# EAGLE design board (EAGLE 7.1.0)
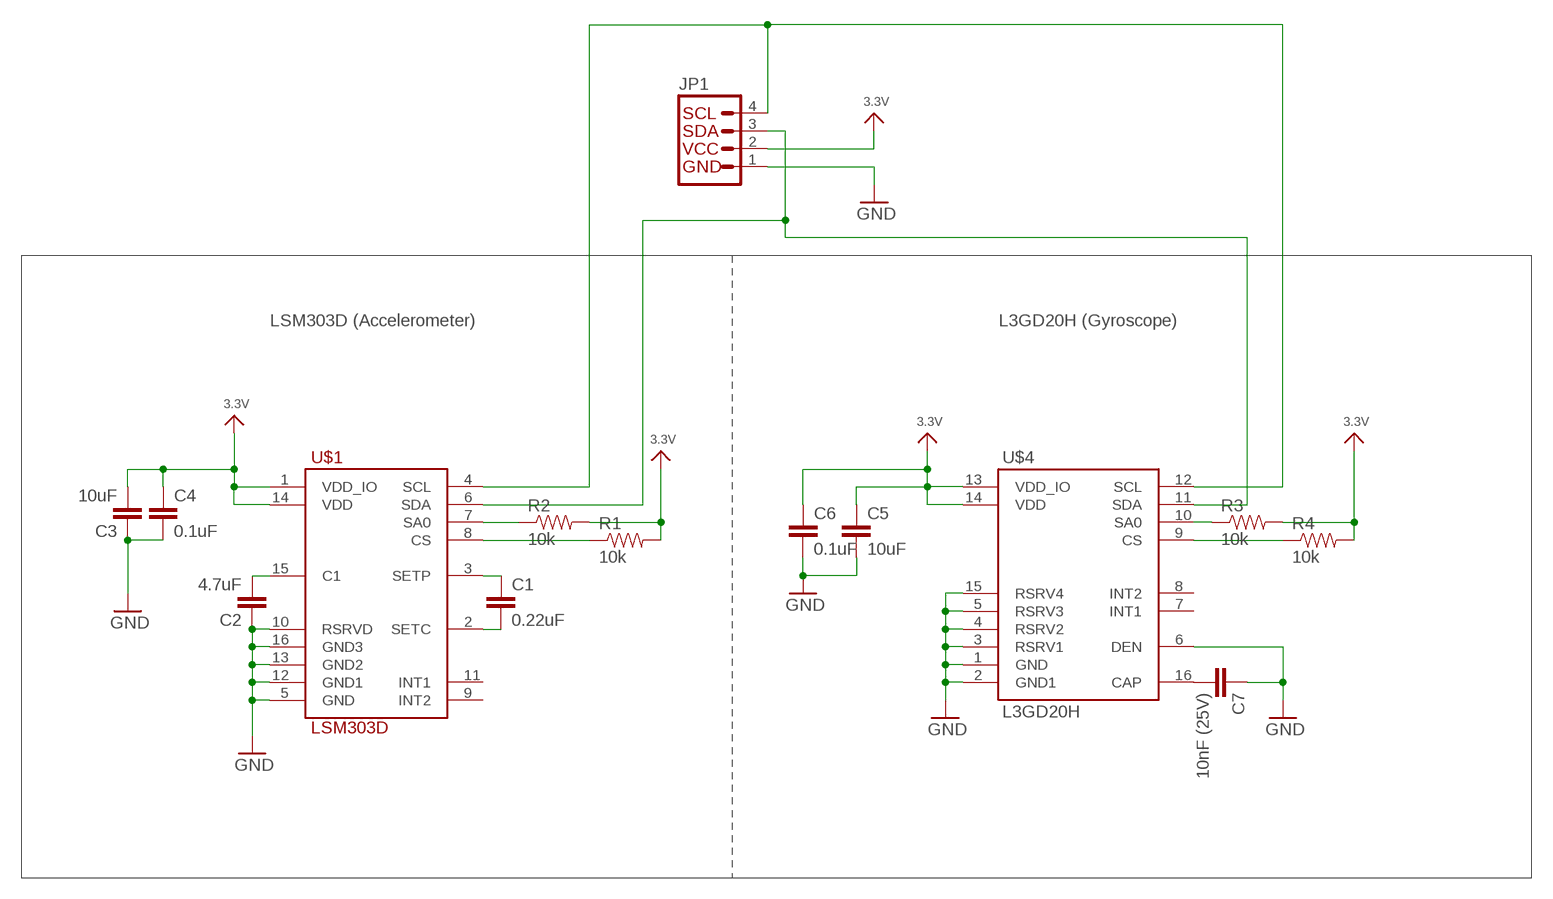
[diagram p0: schematic, sheet 1]

## Parts
C1  0.22uF  CAP0805  [0805]
C2  4.7uF  CAP0805  [0805]
C3  10uF  CAP0805  [0805]
C4  0.1uF  CAP0805  [0805]
C5  10uF  CAP0805  [0805]
C6  0.1uF  CAP0805  [0805]
C7  10nF (25V)  CAP0805  [0805]
JP1  I2C_STANDARD  [1X04]
R1  10k  RESISTOR0805-RES  [0805]
R2  10k  RESISTOR0805-RES  [0805]
R3  10k  RESISTOR0805-RES  [0805]
R4  10k  RESISTOR0805-RES  [0805]
U$1  LSM303D  [LGA16_3X3MM]
U$4  L3GD20H  [LGA16_3X3MM]

## Nets
3.3V: C3.2 C4.1 C5.1 C6.1 JP1.2 R1.2 R2.2 R3.2 R4.2 U$1.1(VDD_IO) U$1.14(VDD) U$4.13(VDD_IO) U$4.14(VDD)
GND: C2.1 C3.1 C4.2 C5.2 C6.2 C7.1 JP1.1 U$1.5(GND) U$1.10(RSRVD) U$1.12(GND1) U$1.13(GND2) U$1.16(GND3) U$4.1(GND) U$4.2(GND1) U$4.3(RSRV1) U$4.4(RSRV2) U$4.5(RSRV3) U$4.6(DEN) U$4.15(RSRV4)
N$1: C1.1 U$1.3(SETP)
N$2: C1.2 U$1.2(SETC)
N$3: R1.1 U$1.8(CS)
N$4: R2.1 U$1.7(SA0)
N$5: C2.2 U$1.15(C1)
N$6: R3.1 U$4.10(SA0)
N$7: R4.1 U$4.9(CS)
N$8: C7.2 U$4.16(CAP)
N$9: JP1.4 U$1.4(SCL) U$4.12(SCL)
N$11: JP1.3 U$1.6(SDA) U$4.11(SDA)
Unconnected: U$1.9(INT2) U$1.11(INT1) U$4.7(INT1) U$4.8(INT2)

## Notes on the sheet
- LSM303D (Accelerometer) | L3GD20H (Gyroscope)

## Library data of the parts
C1-C7 = SparkFun-Capacitors:CAP: Capacitor Standard 0603 ceramic capacitor, and 0.1" leaded capacitor.
JP1 = SparkFun-Connectors:I2C_STANDARD: SparkFun has standardized on a pinout for all I2C based sensor breakouts. This pinout allows I2C boards to be plugged directly into the headers on Arduino Uno compatible boards, and to be daisy chained easily.
R1-R4 = SparkFun-Passives:RESISTOR: Resistor Basic schematic elements and footprints for 0603, 1206, and PTH resistors.
U$1 = IMU_parts:LSM303D
U$4 = IMU_parts:L3GD20H

## Board
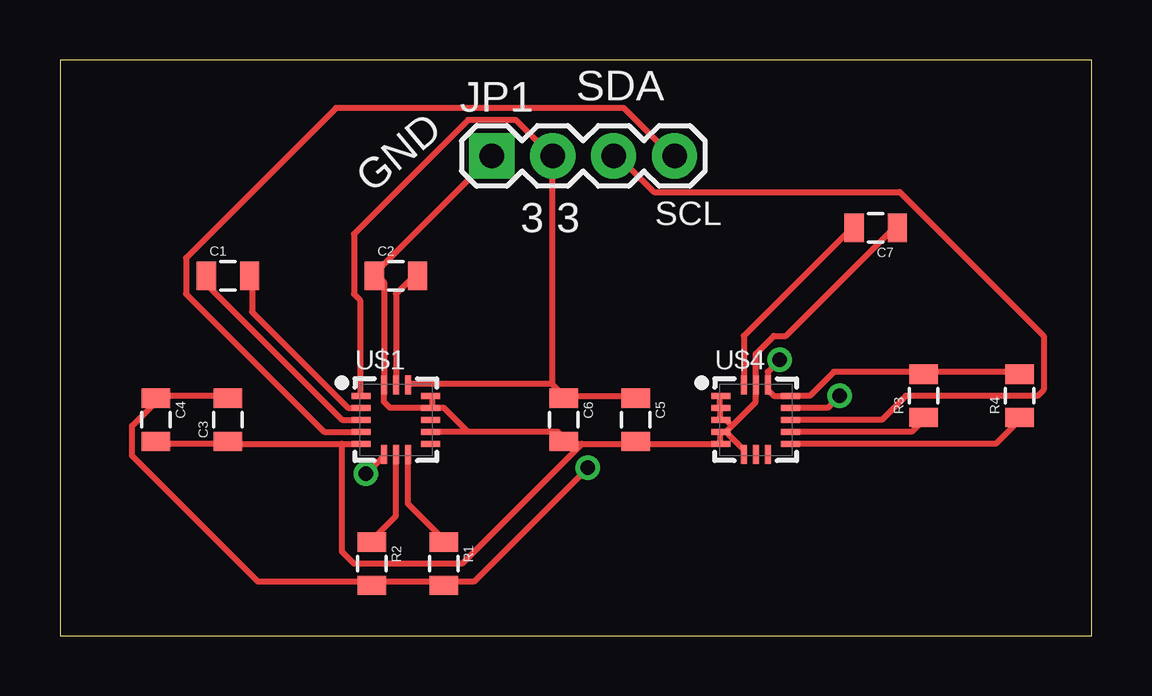
[diagram p1: board, top side]
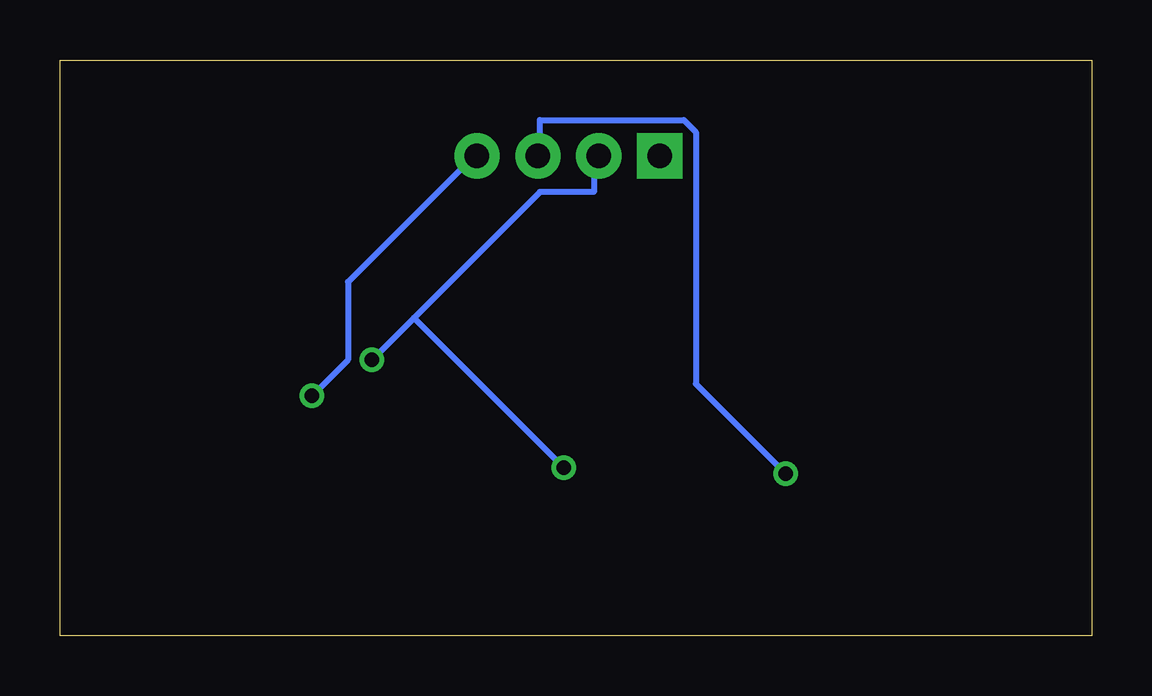
[diagram p2: board, bottom side, seen from below]

Size 43 x 24 mm. Coordinates in mm from the lower left corner, seen from the top.
Outline: 0,0 43,0 43,24 0,24 0,0
Copper layers (1*16): Top 0.035mm / dielectric 1.5mm / Bottom 0.035mm
Design rules "default": minimum track width 10mil, minimum drill 24mil, track to track 8mil, track to pad 8mil, pad to pad 8mil, via to via 8mil, smd to smd 8mil, copper to edge 40mil, drill to drill 8mil, minimum pad ring 10mil, minimum via ring 8mil, stop-mask expansion 4mil, vias tented up to drill 0mil, thermal gap 10mil

### Footprints (pad centres in the part's own frame; a part is rotated, then mirrored left to right if it is on the bottom)
0805 = smd 0.8 x 1.2: 1 -0.9,0; 2 0.9,0
1X04 = drill 1.016 pad 1.88 square: 1 0,0 | drill 1.016 pad 1.88: 2 2.54,0; 3 5.08,0; 4 7.62,0
LGA16_3X3MM = smd 0.8 x 0.25: 1 -1.45,1; 2 -1.45,0.5; 3 -1.45,0; 4 -1.45,-0.5; 5 -1.45,-1; 9 1.45,-1; 10 1.45,-0.5; 11 1.45,0; 12 1.45,0.5; 13 1.45,1 | smd 0.25 x 0.8: 6 -0.5,-1.45; 7 0,-1.45; 8 0.5,-1.45; 14 0.5,1.45; 15 0,1.45; 16 -0.5,1.45

### Placement (x,y rotation side)
C1  7,15 0 top
C2  14,15 0 top
C3  7,9 90 top
C4  4,9 270 top
C5  24,9 270 top
C6  21,9 270 top
C7  34,17 180 top
JP1  18,20 0 top
R1  16,3 270 top
R2  13,3 270 top
R3  36,10 90 top
R4  40,10 90 top
U$1  14,9 0 top
U$4  29,9 0 top

### Tracks (layer width: path | path; a pad name or v marks a point on that pad's centre or on a via)
3.3V  (via drill 0.61)
  Top 0.254: C3.2 7,10 4,10 C4.1 4,9.75 3,8.75 3,7.5 8.25,2.25 13,2.25 | 16,2.25 13,2.25 | 13,2.25 R2.2 | 36,11 40,11 R4.2 | 36,11 32.25,11 31.25,10 U$4.13 29.75,10 29.5,10.25 U$4.14 29.5,11 v30,11.5 | 36,11 R3.2 | 20.5,10.5 14.5,10.5 U$1.14 | 21,10 20.5,10.5 | 21,10 24,10 C5.1 | 21,10 C6.1 | 20.5,20 19,21.5 17,21.5 12.25,16.75 12.25,14.25 12.5,14 12.5,10 U$1.1 | 20.5,20 20.5,10.5 | 20.5,20 JP1.2 | 16,2.25 17.25,2.25 v22,7 | 16,2.25 R1.2
  Bottom 0.254: 28.25,13.25 23,18.5 20.75,18.5 20.75,20 JP1.2 | 28.25,13.25 v30,11.5 | 28.25,13.25 v22,7
GND
  Top 0.254: 27.5,9.5 27.5,9 U$4.3 27.75,9 28,8.75 | 27.5,9.5 27.5,10 U$4.1 | 27.5,9.5 U$4.2 | 27.5,8 27.5,8.5 U$4.4 27.75,8.5 | 27.75,8.5 28.5,7.75 U$4.6 | 27.75,8.5 28,8.75 | 28,8.75 29,9.75 U$4.15 29,11.75 29.75,12.5 30.25,12.5 34.75,17 C7.1 | 7,8 11.75,8 | 11.75,8 U$1.5 | 7,8 4,8 C4.2 | 7,8 C3.1 | 15.5,9.5 15.5,10 U$1.13 | 17,8.5 20.75,8.5 21,8.25 C6.2 21,8 21.75,8 | 17,8.5 U$1.10 | 15.5,9.5 16,9.5 17,8.5 | 15.5,9.5 U$1.12 13.75,9.5 13.5,9.75 U$1.16 13.5,14.75 13.25,15 C2.1 13,15 JP1.1 | 21.75,8 24,8 | 11.75,8 11.75,3.5 12.25,3 16.75,3 21.75,8 | 24,8 27.5,8 | 27.5,8 U$4.5 | 24,8 C5.2
N$1
  Top 0.254: U$1.3 11.75,9 6.25,14.5 6.25,15 C1.1
N$2
  Top 0.254: U$1.2 12,9.5 8,13.5 8,15 C1.2
N$3
  Top 0.254: U$1.8 14.5,5.5 16,4 R1.1
N$4
  Top 0.254: U$1.7 14,5 13,4 R2.1
N$5
  Top 0.254: U$1.15 14,14.25 14.75,15 C2.2
N$6
  Top 0.254: U$4.10 35.5,8.5 36,9 R3.1
N$7
  Top 0.254: U$4.9 39,8 40,9 R4.1
N$8
  Top 0.254: U$4.16 28.5,12.5 33,17 C7.2
N$9  (via drill 0.61)
  Top 0.254: U$1.4 11,8.5 5.25,14.25 5.25,15.75 11.5,22 23.5,22 25.5,20 JP1.4 | U$4.12 32,9.5 v32.5,10
  Bottom 0.254: v32.5,10 31,11.5 31,14.75 25.75,20 JP1.4
N$11  (via drill 0.61)
  Top 0.254: v12.75,6.75 13.5,7.5 U$1.6 | U$4.11 34.25,9 35.25,10 40.75,10 41,10.25 41,12.5 35,18.5 24.75,18.5 23.25,20 JP1.3
  Bottom 0.254: v12.75,6.75 16.5,10.5 16.5,21 17,21.5 23,21.5 23,20 JP1.3

### Text on the board
tNames: SDA | GND | 3 3 | SCL